# EAGLE design xor (EAGLE 9.6.2)
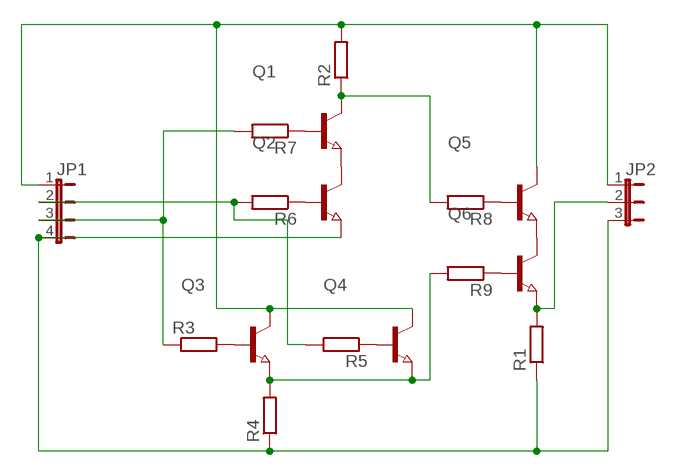
[diagram p0: schematic, sheet 1]

## Parts
JP1  JP4E  [JP4]
JP2  JP2W  [JP2W]
Q1  NPN-TRANSISTOR_SOT23  [SOT23]
Q2  NPN-TRANSISTOR_SOT23  [SOT23]
Q3  NPN-TRANSISTOR_SOT23  [SOT23]
Q4  NPN-TRANSISTOR_SOT23  [SOT23]
Q5  NPN-TRANSISTOR_SOT23  [SOT23]
Q6  NPN-TRANSISTOR_SOT23  [SOT23]
R1  R-EU_R1206  [R1206]
R2  R-EU_R1206  [R1206]
R3  R-EU_R1206  [R1206]
R4  R-EU_R1206  [R1206]
R5  R-EU_R1206  [R1206]
R6  R-EU_R1206  [R1206]
R7  R-EU_R1206  [R1206]
R8  R-EU_R1206  [R1206]
R9  R-EU_R1206  [R1206]

## Nets
N$1: Q1.2(E) Q2.3(C)
N$2: Q5.2(E) Q6.3(C)
N$3: JP2.2 Q6.2(E) R1.2
N$4: Q1.3(C) R2.1 R8.2
N$5: Q3.1(B) R3.2
N$7: Q4.1(B) R5.1
N$8: Q2.1(B) R6.1
N$9: Q1.1(B) R7.1
N$10: Q5.1(B) R8.1
N$11: Q6.1(B) R9.1
N$13: JP1.1 JP2.1 Q3.3(C) Q4.3(C) Q5.3(C) R2.2
N$14: Q3.2(E) Q4.2(E) R4.2 R9.2
N$15: JP1.4 JP2.3 Q2.2(E) R1.1 R4.1
N$16: JP1.2 R5.2 R6.2
N$17: JP1.3 R3.1 R7.2

## Library data of the parts
JP1 = jumper:JP4E: JUMPER
JP2 = jumper:JP2W: JUMPER
Q1-Q6 = semicon-smd-ipc:NPN-TRANSISTOR_: NPN TRANSISTOR
R1-R9 = rcl:R-EU_: RESISTOR, European symbol; SPICEPREFIX: R

## Net classes
0 default: width 1.27 mm

## Board
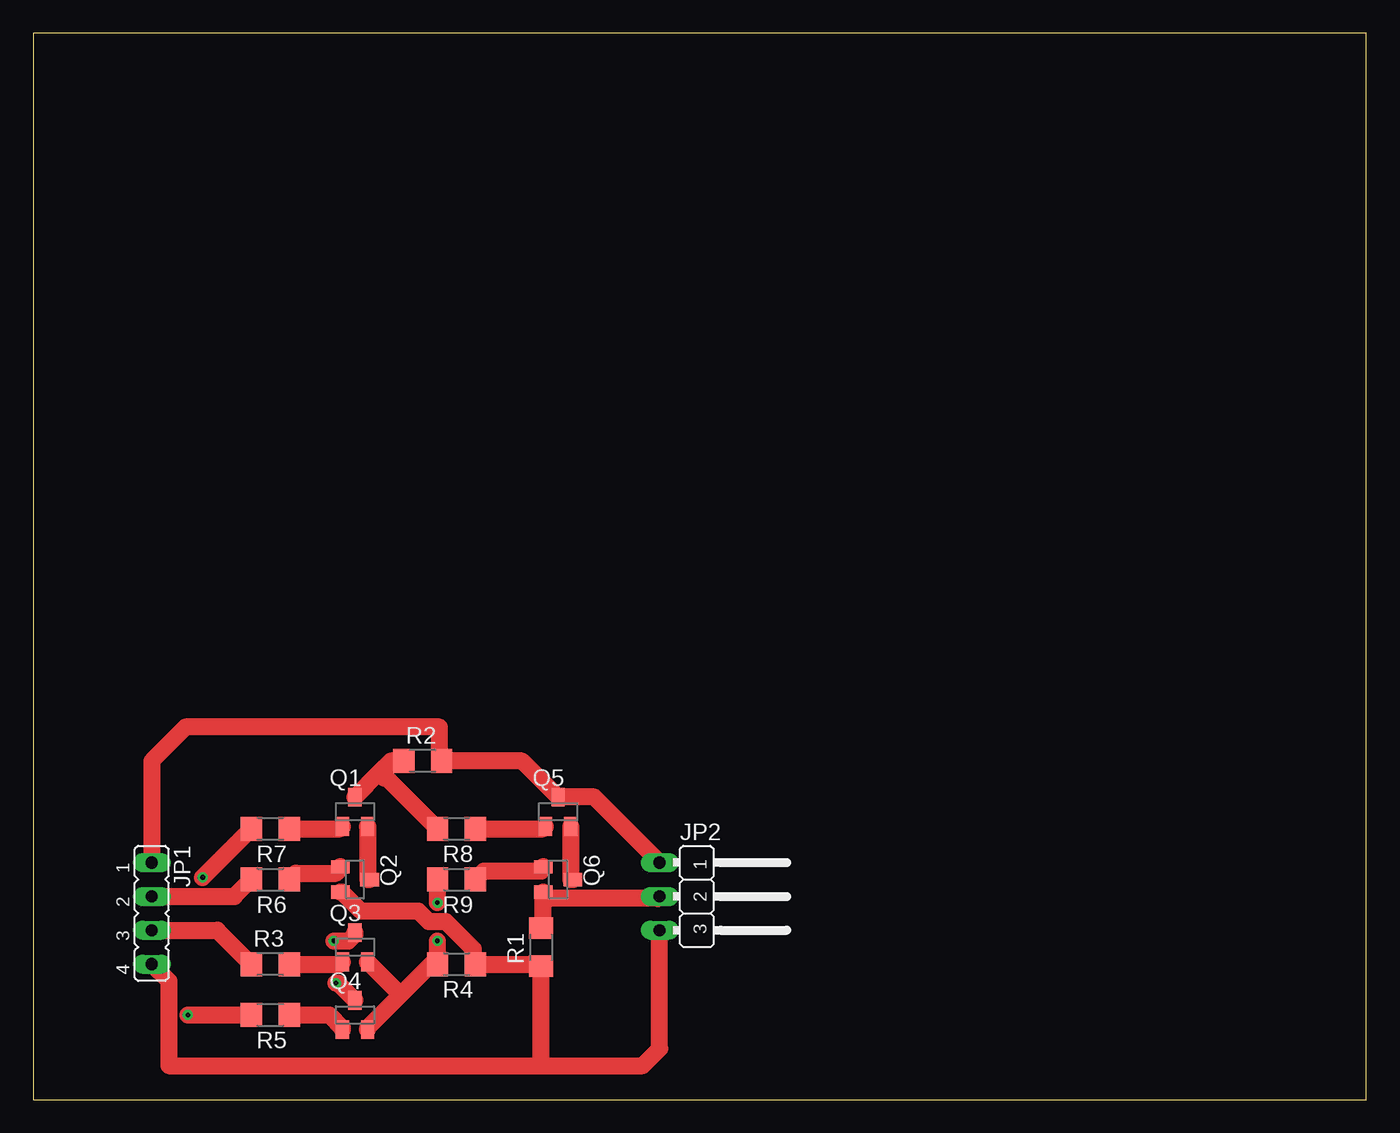
[diagram p1: board, top side]
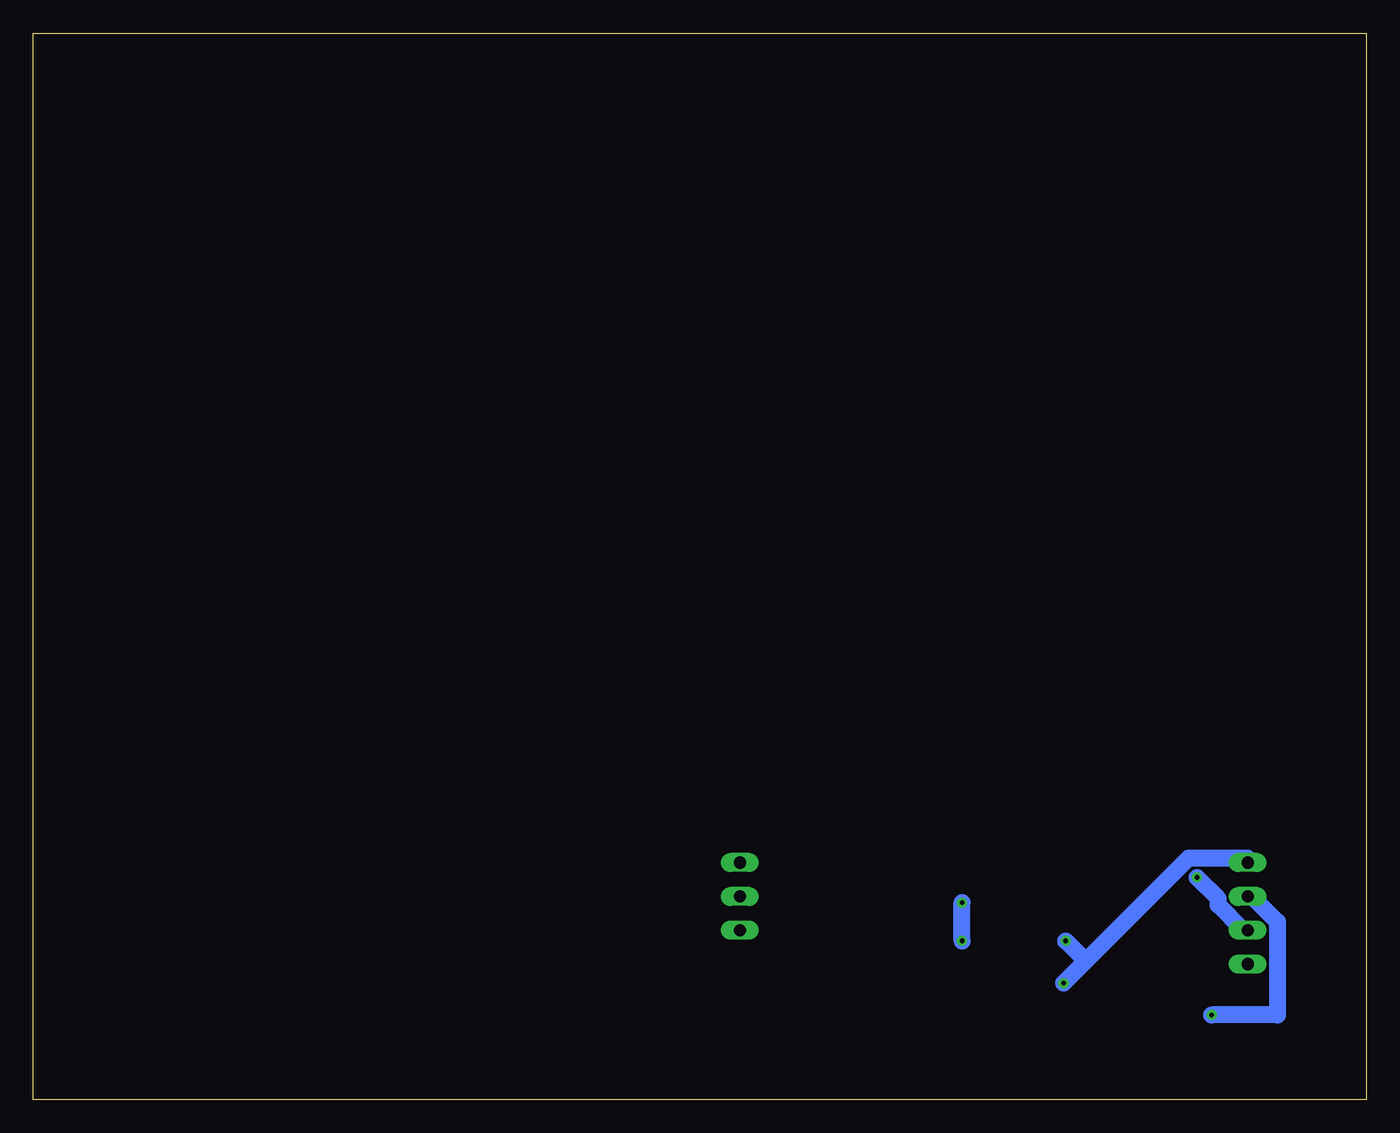
[diagram p2: board, bottom side, seen from below]

Size 100 x 80 mm. Coordinates in mm from the lower left corner, seen from the top.
Outline: 0,0 100,0 100,80 0,80 0,0
Copper layers (1*16): Top 0.035mm / dielectric 1.5mm / Bottom 0.035mm
Design rules "default": minimum track width 6mil, minimum drill 0.35mm, track to track 6mil, track to pad 6mil, pad to pad 6mil, via to via 6mil, smd to smd 6mil, copper to edge 40mil, drill to drill 6mil, minimum pad ring 10mil, minimum via ring 8mil, stop-mask expansion 4mil, vias tented up to drill 0mil, thermal gap 10mil

### Footprints (pad centres in the part's own frame; a part is rotated, then mirrored left to right if it is on the bottom)
JP4 = drill 0.914 long: 1 -3.81,0; 2 -1.27,0; 3 1.27,0; 4 3.81,0
JP2W = drill 0.914 long: 1 -2.54,-1.27; 2 0,-1.27; 3 2.54,-1.27
SOT23 = smd 1 x 1.4: 1 -0.95,-1.1; 2 0.95,-1.1; 3 0,1.1
R1206 = smd 1.6 x 1.803: 1 -1.422,0; 2 1.422,0

### Placement (x,y rotation side)
JP1  8.89,13.97 270 top
JP2  48.26,15.24 270 top
Q1  24.13,21.59 0 top
Q2  24.13,16.51 270 top
Q3  24.13,11.43 0 top
Q4  24.13,6.35 0 top
Q5  39.37,21.59 0 top
Q6  39.37,16.51 270 top
R1  38.1,11.43 90 top
R2  29.21,25.4 0 top
R3  17.78,10.16 0 top
R4  31.75,10.16 180 top
R5  17.78,6.35 180 top
R6  17.78,16.51 180 top
R7  17.78,20.32 180 top
R8  31.75,20.32 180 top
R9  31.75,16.51 180 top

### Tracks (layer width: path | path; a pad name or v marks a point on that pad's centre or on a via)
N$1
  Top 1.27: Q2.3 25.08,16.51 25.08,20.48 Q1.2
N$2
  Top 1.27: Q6.3 40.32,16.51 40.32,20.48 Q5.2
N$3
  Top 1.27: R1.2 38.26,12.86 Q6.2 38.73,15.08 46.83,15.08 JP2.2
N$4
  Top 1.27: 25.96,24.53 26.83,25.4 R2.1 | 25.96,24.53 24.13,22.7 Q1.3 | R8.2 26.51,24.13 26.35,24.13 25.96,24.53
N$5
  Top 1.27: R3.2 23.02,10.16 Q3.1
N$7
  Top 1.27: R5.1 22.23,6.35 23.18,5.4 Q4.1
N$8
  Top 1.27: Q2.1 23.02,17.3 22.7,16.99 19.68,16.99 R6.1
N$9
  Top 1.27: R7.1 23.02,20.32 23.18,20.48 Q1.1
N$10
  Top 1.27: R8.1 38.26,20.32 38.42,20.48 Q5.1
N$11
  Top 1.27: Q6.1 38.26,17.3 38.1,17.14 33.81,17.14 R9.1
N$13  (via drill 0.35)
  Top 1.27: JP2.1 42.08,22.69 Q5.3 36.66,25.4 R2.2 30.48,25.4 30.48,27.94 11.43,27.94 8.89,25.4 JP1.1 | v22.7,8.73 22.86,8.73 24.13,7.46 Q4.3 | v22.54,11.91 23.65,11.91 24.13,12.38 Q3.3
  Bottom 1.27: 21.03,10.4 13.34,18.1 8.89,18.1 JP1.1 | 21.03,10.4 v22.7,8.73 | 21.03,10.4 v22.54,11.91
N$14  (via drill 0.35)
  Top 1.27: 27.54,7.86 29.84,10.16 R4.2 30.32,10.64 v30.32,11.91 | 27.54,7.86 25.08,5.4 Q4.2 | 27.54,7.86 Q3.2 | v30.32,14.76 R9.2
  Bottom 1.27: v30.32,11.91 v30.32,14.76
N$15
  Top 1.27: JP1.4 10.16,8.89 10.16,2.54 38.1,2.54 | 38.1,2.54 45.72,2.54 46.99,3.81 JP2.3 | Q2.2 23.18,15.56 24.61,14.13 28.89,14.13 29.69,13.34 30.96,13.34 33.02,11.27 33.02,10.16 R4.1 38.1,10.16 R1.1 38.1,2.54
N$16  (via drill 0.35)
  Top 1.27: v11.59,6.35 R5.2 | JP1.2 15.08,15.24 R6.2
  Bottom 1.27: v11.59,6.35 6.67,6.35 6.67,13.34 8.57,15.24 JP1.2
N$17  (via drill 0.35)
  Top 1.27: JP1.3 13.81,12.7 R3.1 | v12.7,16.67 R7.2
  Bottom 1.27: v12.7,16.67 11.11,15.08 11.11,14.61 9.21,12.7 JP1.3